# Altium schematic sheet DIGITAL_OUTPUTS_BLOCK_B.SchDoc
size A3; SheetNumber: 9; SheetTotal: 14
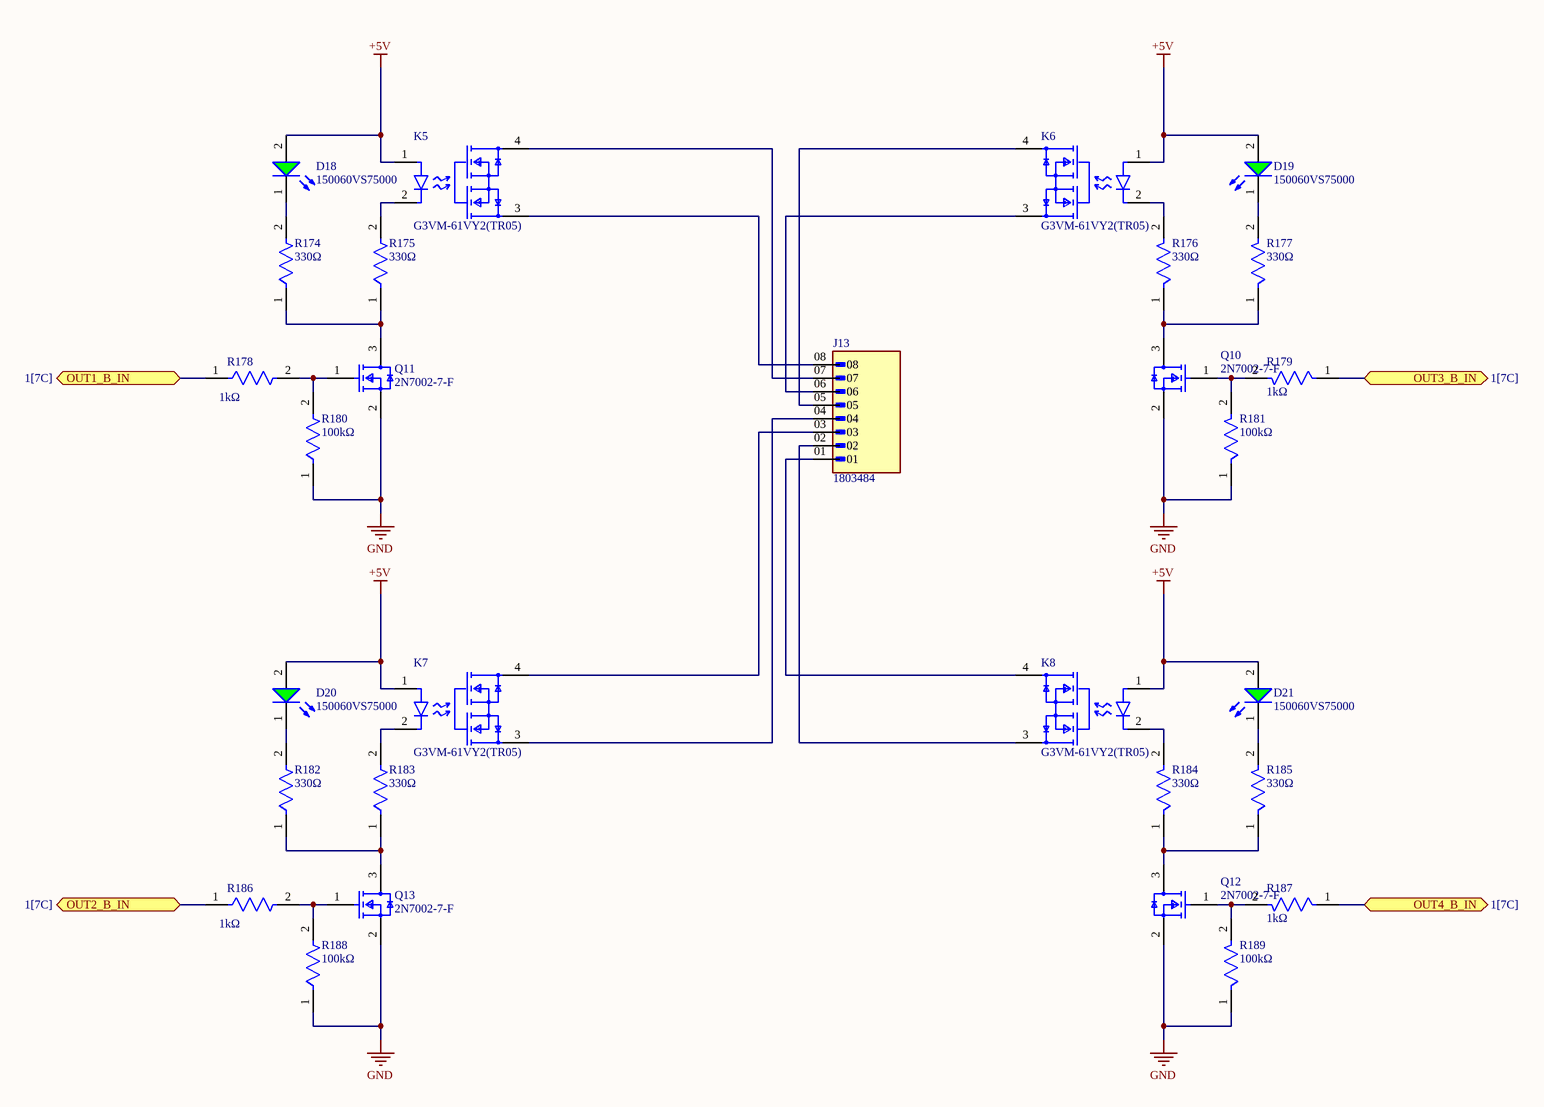
[diagram p0: DIGITAL_OUTPUTS_BLOCK_B.SchDoc]

## Parts
D18  150060VS75000  [WL-SMCW_0603_150060xx75000]
D19  150060VS75000  [WL-SMCW_0603_150060xx75000]
D20  150060VS75000  [WL-SMCW_0603_150060xx75000]
D21  150060VS75000  [WL-SMCW_0603_150060xx75000]
J13  1803484  [PHOENIX_1803484]
K5  G3VM-61VY2(TR05)  [FP-G3VM-61VY2_TR05-MFG]
K6  G3VM-61VY2(TR05)  [FP-G3VM-61VY2_TR05-MFG]
K7  G3VM-61VY2(TR05)  [FP-G3VM-61VY2_TR05-MFG]
K8  G3VM-61VY2(TR05)  [FP-G3VM-61VY2_TR05-MFG]
Q10  2N7002-7-F  [FP-SOT23-IPC_A]
Q11  2N7002-7-F  [FP-SOT23-IPC_A]
Q12  2N7002-7-F  [FP-SOT23-IPC_A]
Q13  2N7002-7-F  [FP-SOT23-IPC_A]
R174  Resistance: 330Ω  [FP-CRCW0603-e3-MFG]  (hidden comment: CRCW0603330RFKEA)
R175  Resistance: 330Ω  [FP-CRCW0603-e3-MFG]  (hidden comment: CRCW0603330RFKEA)
R176  Resistance: 330Ω  [FP-CRCW0603-e3-MFG]  (hidden comment: CRCW0603330RFKEA)
R177  Resistance: 330Ω  [FP-CRCW0603-e3-MFG]  (hidden comment: CRCW0603330RFKEA)
R178  Resistance: 1kΩ  [FP-AC0603-IPC_B]  (hidden comment: AC0603FR-071KL)
R179  Resistance: 1kΩ  [FP-AC0603-IPC_B]  (hidden comment: AC0603FR-071KL)
R180  Resistance: 100kΩ  [FP-CRCW0603-e3-IPC_B]  (hidden comment: CRCW0603100KFKEC)
R181  Resistance: 100kΩ  [FP-CRCW0603-e3-IPC_B]  (hidden comment: CRCW0603100KFKEC)
R182  Resistance: 330Ω  [FP-CRCW0603-e3-MFG]  (hidden comment: CRCW0603330RFKEA)
R183  Resistance: 330Ω  [FP-CRCW0603-e3-MFG]  (hidden comment: CRCW0603330RFKEA)
R184  Resistance: 330Ω  [FP-CRCW0603-e3-MFG]  (hidden comment: CRCW0603330RFKEA)
R185  Resistance: 330Ω  [FP-CRCW0603-e3-MFG]  (hidden comment: CRCW0603330RFKEA)
R186  Resistance: 1kΩ  [FP-AC0603-IPC_B]  (hidden comment: AC0603FR-071KL)
R187  Resistance: 1kΩ  [FP-AC0603-IPC_B]  (hidden comment: AC0603FR-071KL)
R188  Resistance: 100kΩ  [FP-CRCW0603-e3-IPC_B]  (hidden comment: CRCW0603100KFKEC)
R189  Resistance: 100kΩ  [FP-CRCW0603-e3-IPC_B]  (hidden comment: CRCW0603100KFKEC)

## Ports
OUT1_B_IN (bidir, see 1[7C]), OUT2_B_IN (bidir, see 1[7C]), OUT3_B_IN (bidir, see 1[7C]), OUT4_B_IN (bidir, see 1[7C])

## Nets
+5V: D18.2(A) D19.2(A) D20.2(A) D21.2(A) K5.1(A) K6.1(A) K7.1(A) K8.1(A)
GND: Q10.2(S) Q11.2(S) Q12.2(S) Q13.2(S) R180.1 R181.1 R188.1 R189.1
OUT1_B_IN: R178.1 ; port OUT1_B_IN
OUT2_B_IN: R186.1 ; port OUT2_B_IN
OUT3_B_IN: R179.1 ; port OUT3_B_IN
OUT4_B_IN: R187.1 ; port OUT4_B_IN
NetD18_1: D18.1(K) R174.2
NetD19_1: D19.1(K) R177.2
NetD20_1: D20.1(K) R182.2
NetD21_1: D21.1(K) R185.2
NetJ13_01: J13.01 K8.4(2_DRAIN)
NetJ13_02: J13.02 K8.3(1_DRAIN)
NetJ13_03: J13.03 K7.4(2_DRAIN)
NetJ13_04: J13.04 K7.3(1_DRAIN)
NetJ13_05: J13.05 K6.4(2_DRAIN)
NetJ13_06: J13.06 K6.3(1_DRAIN)
NetJ13_07: J13.07 K5.4(2_DRAIN)
NetJ13_08: J13.08 K5.3(1_DRAIN)
NetK5_2: K5.2(C) R175.2
NetK6_2: K6.2(C) R176.2
NetK7_2: K7.2(C) R183.2
NetK8_2: K8.2(C) R184.2
NetQ10_1: Q10.1(G) R179.2 R181.2
NetQ10_3: Q10.3(D) R176.1 R177.1
NetQ11_1: Q11.1(G) R178.2 R180.2
NetQ11_3: Q11.3(D) R174.1 R175.1
NetQ12_1: Q12.1(G) R187.2 R189.2
NetQ12_3: Q12.3(D) R184.1 R185.1
NetQ13_1: Q13.1(G) R186.2 R188.2
NetQ13_3: Q13.3(D) R182.1 R183.1

## Library data of the parts
D18-D21 = CMP-1426-00006-6: NexarPartId: 29717778; Reverse Voltage: 5V; Forward Voltage: 2V; Viewing Angle: 140°; Luminous Intensity: 40mcd; Test Current: 20mA; Max Junction Temperature (Tj): 95°C; Wavelength: 570nm; Forward Current: 100mA; Color: Green; Lens Style: Clear, Rectangular; Power Dissipation: 72mW; Peak Wavelength: 572nm; Packaging: Tape and Reel; REACH SVHC: Unknown; Width: 800µm; Max Operating Temperature: 85°C; Number of Pins: 2; RoHS: Compliant; Dominant Wavelength: 570nm; Min Operating Temperature: -40°C; Case Code (Imperial): 0603; Height: 700µm; Length: 1.6mm; Case Code (Metric): 1608; Case/Package: 0603; Max Reverse Voltage (DC): 5V; Mount: Surface Mount
J13 = 1803484: MF: {'manufacturer': u'Phoenix Contact'}; Package: None; Price: None; Value: *; MP: 1803484; Availability: Unavailable
K5-K8 = CMP-08825-000057-1: SSR RELAY SPST-NO 500MA 0-60V; Throw Configuration: SPST; On-State Resistance: 2R; Load Current: 500mA; RoHS Compliant: Yes; Relay Type: Relay; Case/Package: SOP; Mount: Surface Mount; Termination: Gull Wing; Number of Pins: 4; Packaging: Tape and Reel
Q10-Q13 = CMP-2000-04929-2: MOSFET N-CH 60V 115MA SOT23-3; Turn-On Delay Time: 7ns; Turn-Off Delay Time: 11ns; Drain to Source Resistance: 7.5R; Rise Time: 3ns; Drain to Source Breakdown Voltage: 70V; Input Capacitance: 50pF; Number of Elements: 1; Power Dissipation: 540mW; Max Power Dissipation: 300mW; Fall Time: 5.6ns; Gate to Source Voltage (Vgs): 20V; Threshold Voltage: 2.5V; Element Configuration: Single; Termination: SMD/SMT; Weight: 0.000282oz; Radiation Hardening: No; Max Operating Temperature: 150°C; On-State Resistance: 7.5R; Mount: Surface Mount; Current Rating: 115mA; Contact Plating: Tin; Lead Free: Lead Free; Min Operating Temperature: -55°C; Number of Pins: 3; REACH SVHC: No SVHC; Drain to Source Voltage (Vdss): 60V; Width: 1.3mm; Package Quantity: 3000; Length: 2.9mm; Case/Package: SOT-23; Number of Channels: 1; Dual Supply Voltage: 60V; Packaging: Tape and Reel; Height: 1mm; Voltage Rating (DC): 60V; Nominal Vgs: 2.5V; Continuous Drain Current (ID): 115mA; Voltage: 60V; Rds On Max: 7.5R
R174-R177 R182-R185 = CMP-1012-00454-3: RES Thick Film, 330Ω, 1%, 0.1W, 100ppm/°C, 0603; Voltage Rating: 75V; Max Power Dissipation: 100mW; Depth: 0.85mm; Contact Plating: Tin; Package Quantity: 10; Termination: SMD/SMT; Tolerance: 1%; Height: 0.45mm; Number of Terminations: 2; Radiation Hardening: No; Features: Automotive AEC-Q200; Case/Package: 0603; Mount: Surface Mount; Case Code (Metric): 1608; Lead Free: Lead Free; Temperature Coefficient: 100ppm/°C; Weight: 7.1E-05oz; Military Standard: Not; Packaging: Tape and Reel; Max Operating Temperature: 155°C; Voltage Rating (DC): 75V; Length: 1.55mm; Min Operating Temperature: -55°C; Composition: Thick Film; Case Code (Imperial): 0603; Width: 0.033inch; Power Rating: 100mW
R178 R179 R186 R187 = CMP-2000-04828-3: RES 1kΩ 1.00% 0.1W 0603; Voltage Rating: 50V; Power Rating: 100mW; Tolerance: 1%; Temperature Coefficient: 100ppm/°C; Depth: 0.8mm; Case/Package: 0603; Size Code: 0603; Case Code (Metric): 1608; Height: 0.022inch; Series: AC; Width: 0.031inch; Construction: Rectangular; Length: 0.063inch; Case Code (Imperial): 0603; Package Quantity: 1; RoHS Compliant: Yes; Features: Moisture Resistant; Resistor Type: Thick Film; Max Power Dissipation: 100mW; Packaging: Tape and Reel; Termination: SMD/SMT; Ratings: AEC-Q200; Max Operating Temperature: 155°C; Min Operating Temperature: -55°C; Military Standard: Not; Lead Free: Lead Free; Number of Terminations: 2
R180 R181 R188 R189 = CMP-2000-03822-2: RES Thick Film, 100kΩ, 1%, 0.1W, 100ppm/°C, 0603; Power Rating: 100mW; Height: 0.02inch; Min Operating Temperature: -55°C; Length: 0.061inch; Temperature Coefficient: 100ppm/°C; Number of Terminations: 2; Packaging: Tape and Reel; Case Code (Imperial): 0603; Case/Package: 0603; Contact Plating: Tin; Radiation Hardening: No; Lead Free: Lead Free; Depth: 0.85mm; Case Code (Metric): 1608; Max Power Dissipation: 100mW; Features: Automotive AEC-Q200; Tolerance: 1%; Max Operating Temperature: 155°C; Composition: Thick Film; Military Standard: Not; Width: 0.033inch